# EAGLE design JPhan_Board3 (EAGLE 8.3.2)
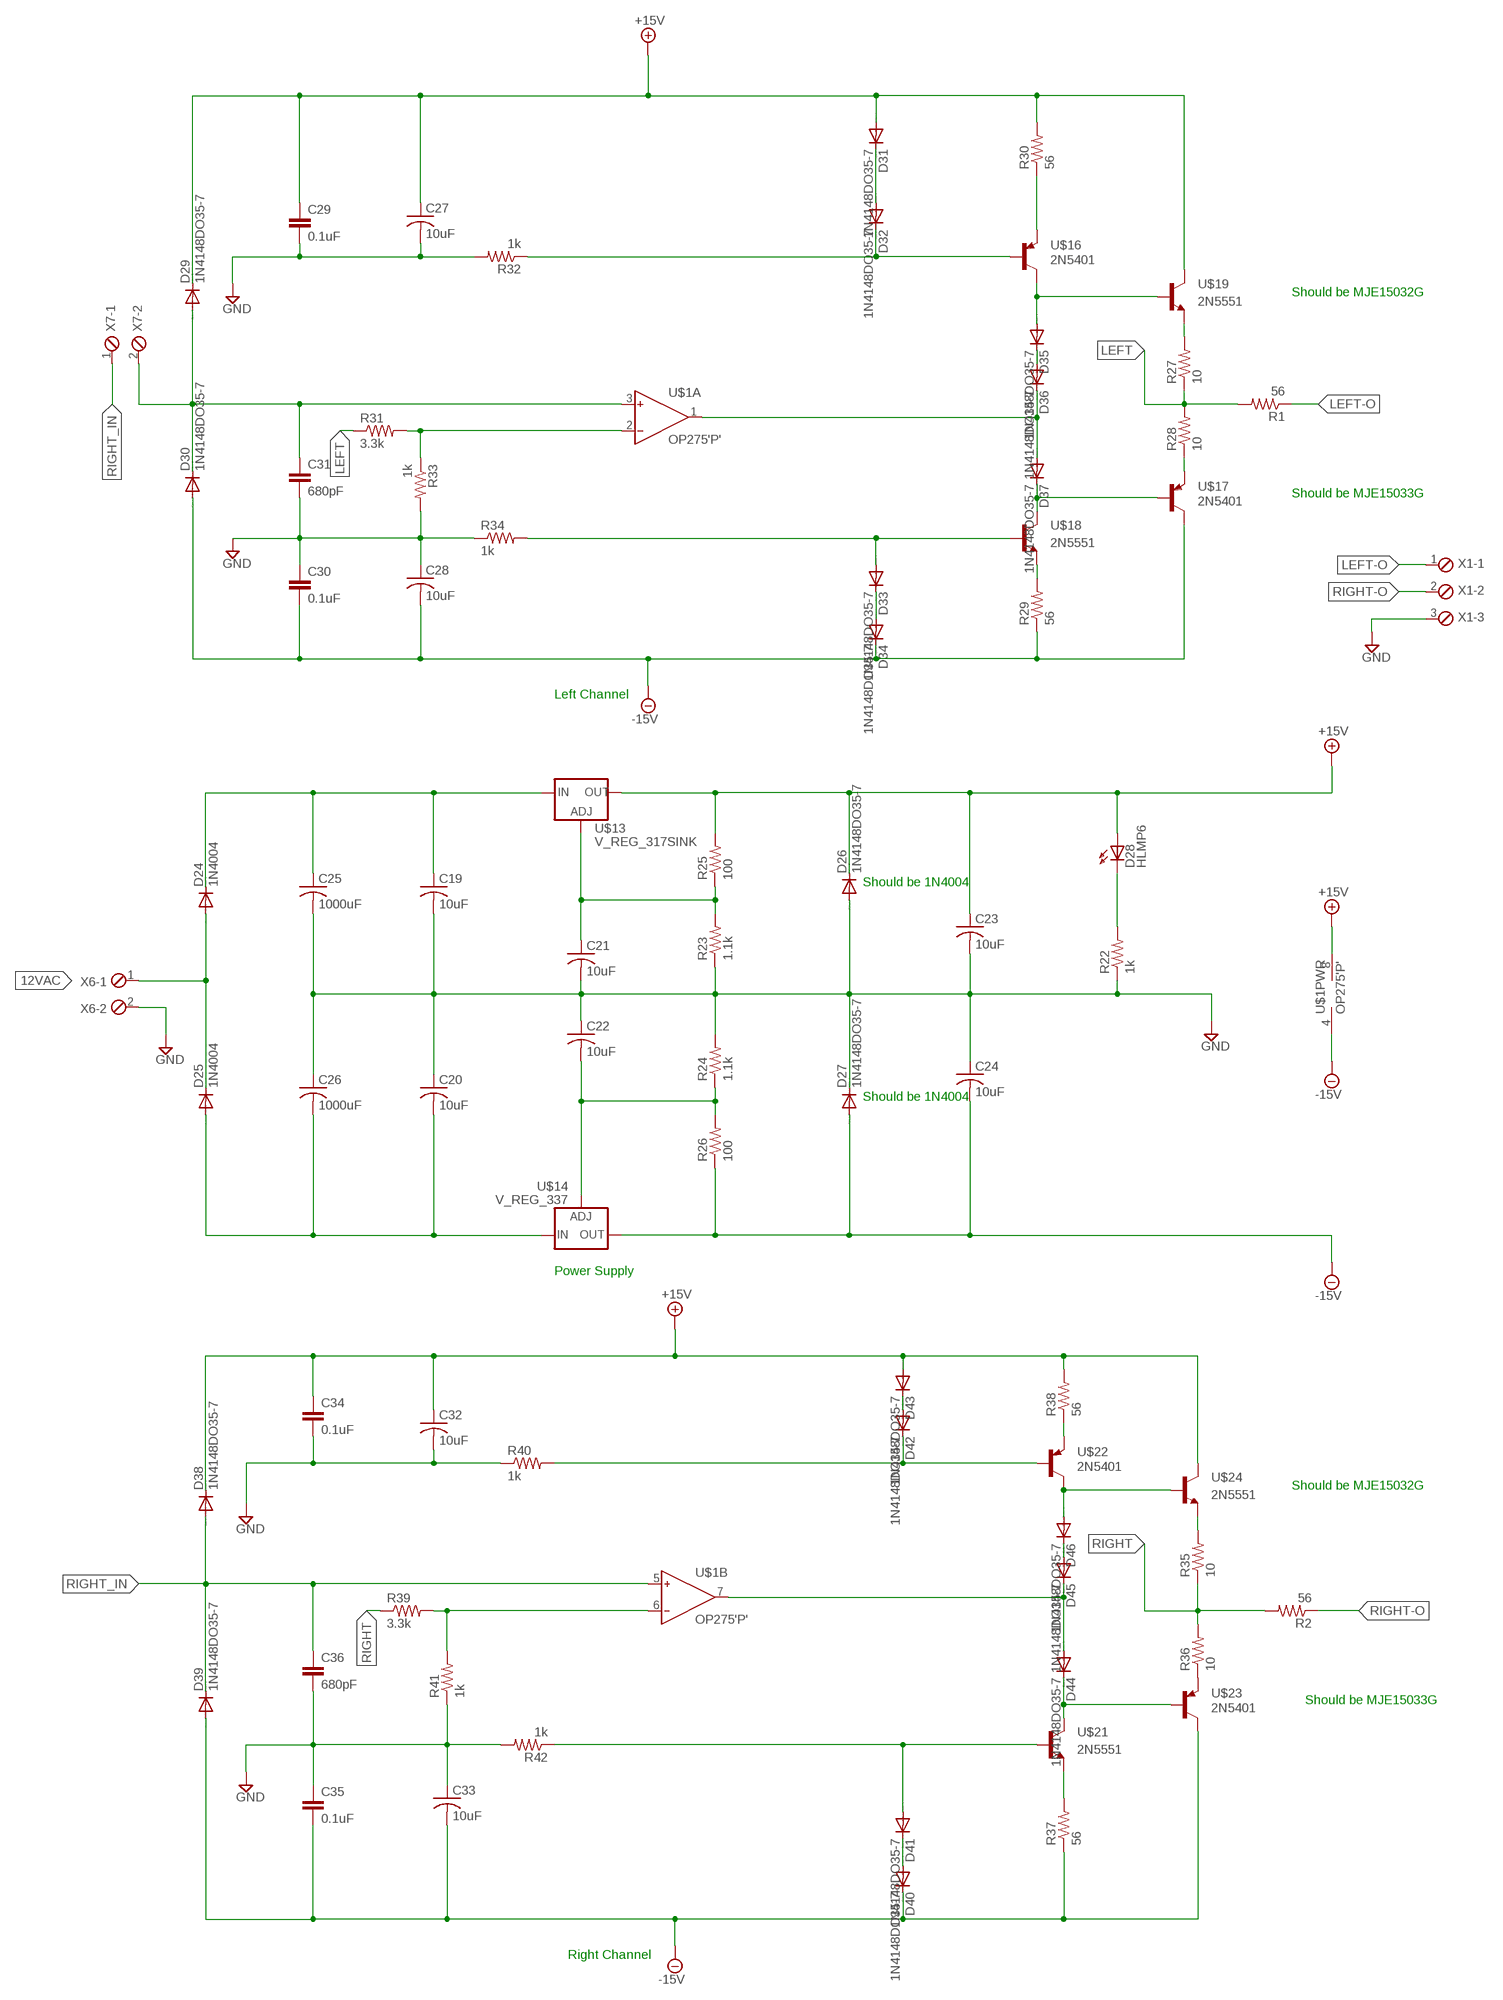
[diagram p0: schematic, sheet 1]

## Parts
C19  10uF  C-US025-030X050  [C025-030X050]
C20  10uF  C-US025-030X050  [C025-030X050]
C21  10uF  C-US025-030X050  [C025-030X050]
C22  10uF  C-US025-030X050  [C025-030X050]
C23  10uF  C-US025-030X050  [C025-030X050]
C24  10uF  C-US025-030X050  [C025-030X050]
C25  1000uF  C-US050-045X075  [C050-045X075]
C26  1000uF  C-US050-045X075  [C050-045X075]
C27  10uF  C-US025-030X050  [C025-030X050]
C28  10uF  C-US025-030X050  [C025-030X050]
C29  0.1uF  C-EU025-024X044  [C025-024X044]
C30  0.1uF  C-EU025-024X044  [C025-024X044]
C31  680pF  C-EU025-024X044  [C025-024X044]
C32  10uF  C-US025-030X050  [C025-030X050]
C33  10uF  C-US025-030X050  [C025-030X050]
C34  0.1uF  C-EU025-024X044  [C025-024X044]
C35  0.1uF  C-EU025-024X044  [C025-024X044]
C36  680pF  C-EU025-024X044  [C025-024X044]
D24  1N4004  [DO41-10]
D25  1N4004  [DO41-10]
D26  1N4148DO35-7  [DO35-7]
D27  1N4148DO35-7  [DO35-7]
D28  HLMP6  [HLMP6]
D29  1N4148DO35-7  [DO35-7]
D30  1N4148DO35-7  [DO35-7]
D31  1N4148DO35-7  [DO35-7]
D32  1N4148DO35-7  [DO35-7]
D33  1N4148DO35-7  [DO35-7]
D34  1N4148DO35-7  [DO35-7]
D35  1N4148DO35-7  [DO35-7]
D36  1N4148DO35-7  [DO35-7]
D37  1N4148DO35-7  [DO35-7]
D38  1N4148DO35-7  [DO35-7]
D39  1N4148DO35-7  [DO35-7]
D40  1N4148DO35-7  [DO35-7]
D41  1N4148DO35-7  [DO35-7]
D42  1N4148DO35-7  [DO35-7]
D43  1N4148DO35-7  [DO35-7]
D44  1N4148DO35-7  [DO35-7]
D45  1N4148DO35-7  [DO35-7]
D46  1N4148DO35-7  [DO35-7]
R1  56  R-US_0204/7  [0204/7]
R2  56  R-US_0204/7  [0204/7]
R22  1k  R-US_0204/7  [0204/7]
R23  1.1k  R-US_0204/7  [0204/7]
R24  1.1k  R-US_0204/7  [0204/7]
R25  100  R-US_0204/7  [0204/7]
R26  100  R-US_0204/7  [0204/7]
R27  10  R-US_0204/7  [0204/7]
R28  10  R-US_0204/7  [0204/7]
R29  56  R-US_0204/7  [0204/7]
R30  56  R-US_0204/7  [0204/7]
R31  3.3k  R-US_0204/7  [0204/7]
R32  1k  R-US_0204/7  [0204/7]
R33  1k  R-US_0204/7  [0204/7]
R34  1k  R-US_0204/7  [0204/7]
R35  10  R-US_0204/7  [0204/7]
R36  10  R-US_0204/7  [0204/7]
R37  56  R-US_0204/7  [0204/7]
R38  56  R-US_0204/7  [0204/7]
R39  3.3k  R-US_0204/7  [0204/7]
R40  1k  R-US_0204/7  [0204/7]
R41  1k  R-US_0204/7  [0204/7]
R42  1k  R-US_0204/7  [0204/7]
U$1  OP275'P'  [DIL08]
U$13  V_REG_317SINK  [TO220-ADJ]
U$14  V_REG_337  [TO220-ADJ-NEG]
U$16  2N5401  [2N5401]
U$17  2N5401  [2N5401]
U$18  2N5551  [2N5551]
U$19  2N5551  [2N5551]
U$21  2N5551  [2N5551]
U$22  2N5401  [2N5401]
U$23  2N5401  [2N5401]
U$24  2N5551  [2N5551]
X1  MPT3  [3POL254]
X6  MPT2  [2POL254]
X7  MPT2  [2POL254]

## Nets
12VAC: D24.A D25.C X6.1
+15V [+15V]: C23.1 C27.1 C29.1 C32.1 C34.1 D26.C D28.A D29.C D31.A D38.C D43.A R25.2 R30.2 R38.2 U$1.8(PWR:V+) U$13.OUT U$19.C U$24.C
-15V [-15V]: C24.2 C28.2 C30.2 C33.2 C35.2 D27.A D30.A D34.C D39.A D40.C R26.1 R29.1 R37.1 U$1.4(PWR:V-) U$14.OUT U$17.C U$23.C
GND [GND]: C19.2 C20.1 C21.2 C22.1 C23.2 C24.1 C25.2 C26.1 C27.2 C28.1 C29.2 C30.1 C31.2 C32.2 C33.1 C34.2 C35.1 C36.2 D26.A D27.C R22.1 R23.1 R24.2 R32.2 R33.2 R34.1 R40.1 R41.1 R42.2 X1.3 X6.2
LEFT: R1.2 R27.1 R28.2 R31.1
LEFT-O: R1.1 X1.1
N$1: C31.1 D29.A D30.C U$1.3(A:IN+) X7.2
N$4: R31.2 R33.1 U$1.2(A:IN-)
N$43: C19.1 C25.1 D24.C U$13.IN
N$45: C20.2 C26.2 D25.A U$14.IN
N$47: C21.1 R23.2 R25.1 U$13.ADJ
N$48: C22.2 R24.1 R26.2 U$14.ADJ
N$50: D28.K R22.2
N$51: D35.A U$16.C U$19.B
N$56: D32.C R32.1 U$16.B
N$57: D31.C D32.A
N$58: R30.1 U$16.E
N$59: D35.C D36.A
N$60: D36.C D37.A U$1.1(A:OUT)
N$61: D37.C U$17.B U$18.C
N$62: R29.2 U$18.E
N$63: D33.C D34.A
N$64: R27.2 U$19.E
N$65: R28.1 U$17.E
N$67: D33.A R34.2 U$18.B
N$71: R39.2 R41.2 U$1.6(B:IN-)
N$73: D40.A D41.C
N$74: R37.2 U$21.E
N$75: D44.C U$21.C U$23.B
N$76: D44.A D45.C U$1.7(B:OUT)
N$77: D45.A D46.C
N$78: D46.A U$22.C U$24.B
N$79: D42.A D43.C
N$80: D42.C R40.2 U$22.B
N$81: D41.A R42.1 U$21.B
N$82: R35.2 U$24.E
N$83: R36.1 U$23.E
N$84: R38.1 U$22.E
RIGHT: R2.2 R35.1 R36.2 R39.1
RIGHT-O: R2.1 X1.2
RIGHT_IN: C36.1 D38.A D39.C U$1.5(B:IN+) X7.1

## Notes on the sheet
- Should be MJE15032G
- Should be MJE15033G
- Left Channel
- Should be 1N4004
- Should be 1N4004
- Power Supply
- Should be MJE15032G
- Should be MJE15033G
- Right Channel

## Library data of the parts
C19-C28 C32 C33 = rcl:C-US: CAPACITOR, American symbol
C29-C31 C34-C36 = rcl:C-EU: CAPACITOR, European symbol
D24 D25 = diode:1N4004: DIODE general purpose rectifier, 1 A
D26 D27 D29-D46 = diode:1N4148: DIODE high speed (Philips)
D28 = display-hp:HLMP6: LED 2mm horizontal; MF: AGILENT TECHNOLOGIES; MPN: HLMP-6500; OC_FARNELL: 1652490; OC_NEWARK: 40K0088
R1 R2 R22-R42 = resistor:R-US_: RESISTOR, American symbol
U$1 = engr301-proj :OP275: OP275 - Dual Bipolar/JFET Audio Op-amp
U$13 = engr301-proj :V_REG_317: Voltage Regulator Standard LM317 adjustable voltage regulator. AOI (Adjust Output Input). Google 'LM317 Calculator' for easy to use app to get the two resistor values needed. 240/720 for 5V output. 240/390 for 3.3V output. Spark Fun Electronics SKU : COM-00527
U$14 = engr301-proj :V_REG_337: LM-337 Negative Adjustable Voltage Regulator
U$16 U$17 U$22 U$23 = engr301-proj :2N5401
U$18 U$19 U$21 U$24 = engr301-proj :2N5551
X1 = con-phoenix-254:MPT3: PHOENIX CONNECTOR; OC_FARNELL: unknown; OC_NEWARK: unknown
X6 X7 = con-phoenix-254:MPT2: PHOENIX CONNECTOR; OC_FARNELL: unknown; OC_NEWARK: unknown

## Net classes
0 default: width 0.356 mm, drill 0.254 mm, clearance 0.254 mm
1 GND: width 0.406 mm, drill 0.406 mm, clearance 0.406 mm
2 +15V: width 0.61 mm, drill 0.61 mm, clearance 0.406 mm
3 -15V: width 0.61 mm, drill 0.61 mm, clearance 0.406 mm

## Board
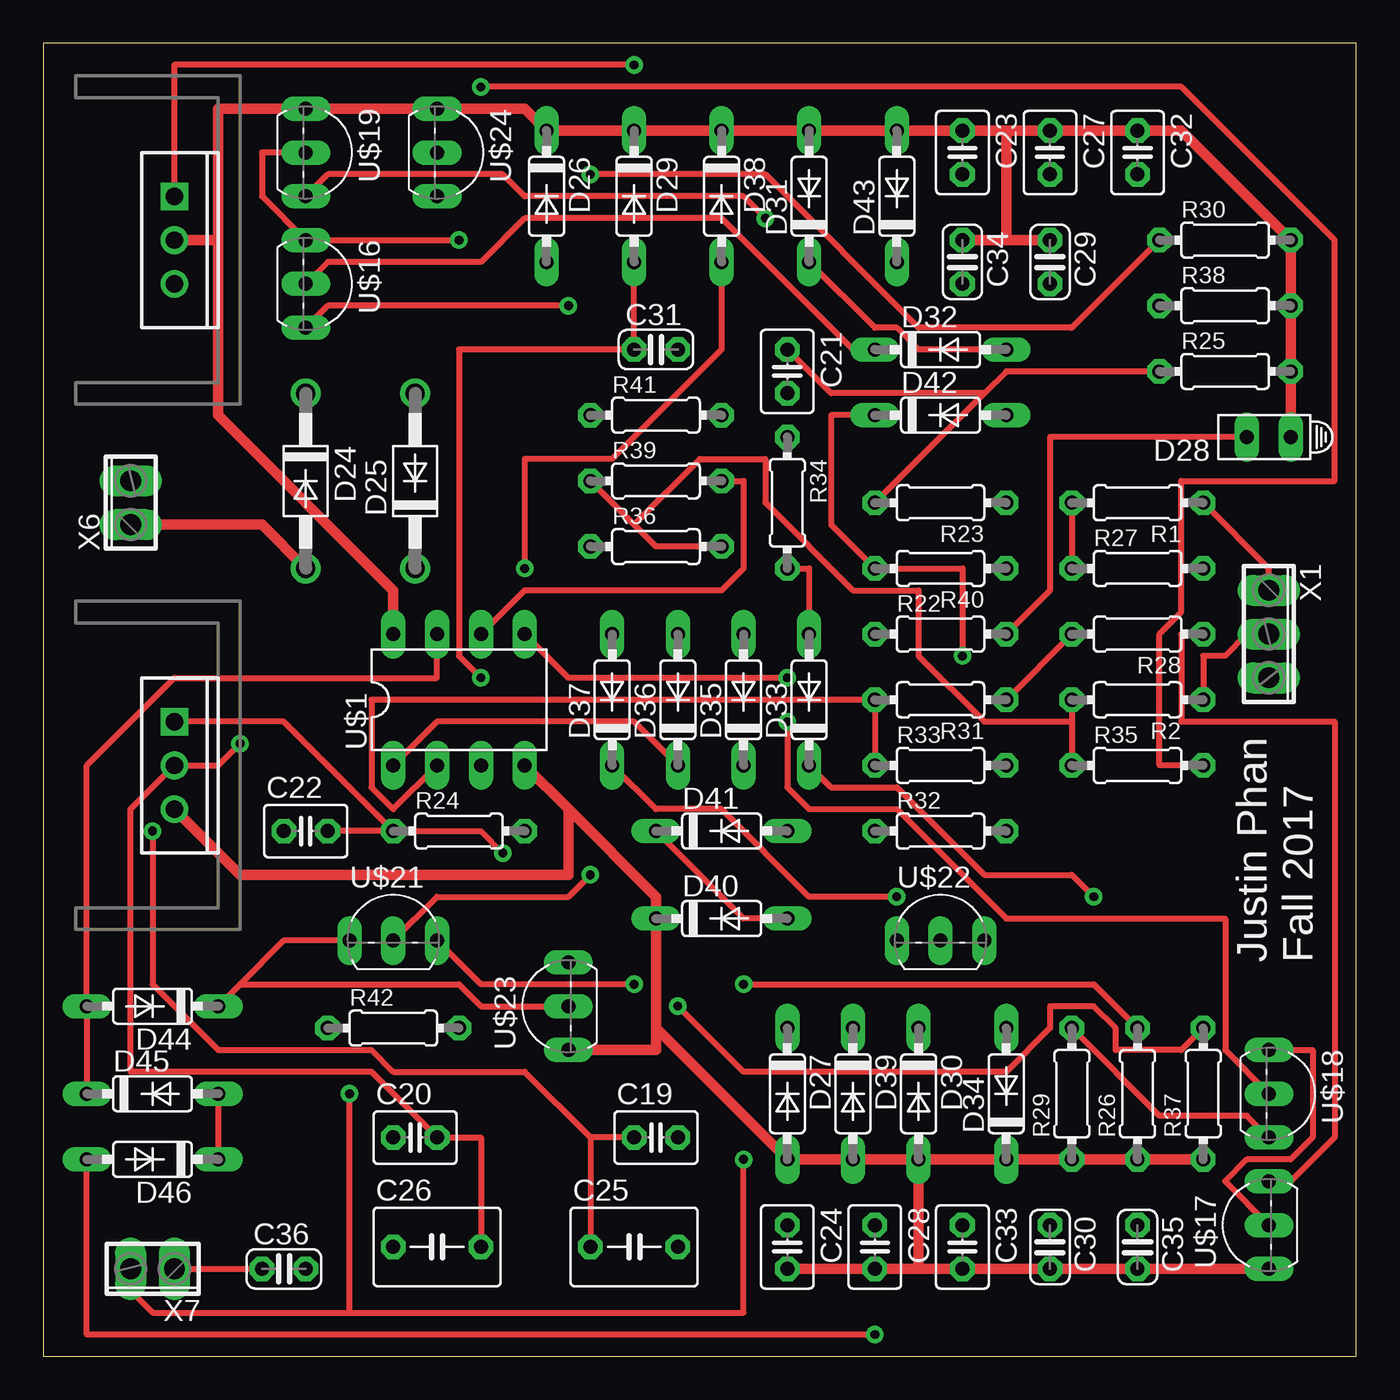
[diagram p1: board, top side]
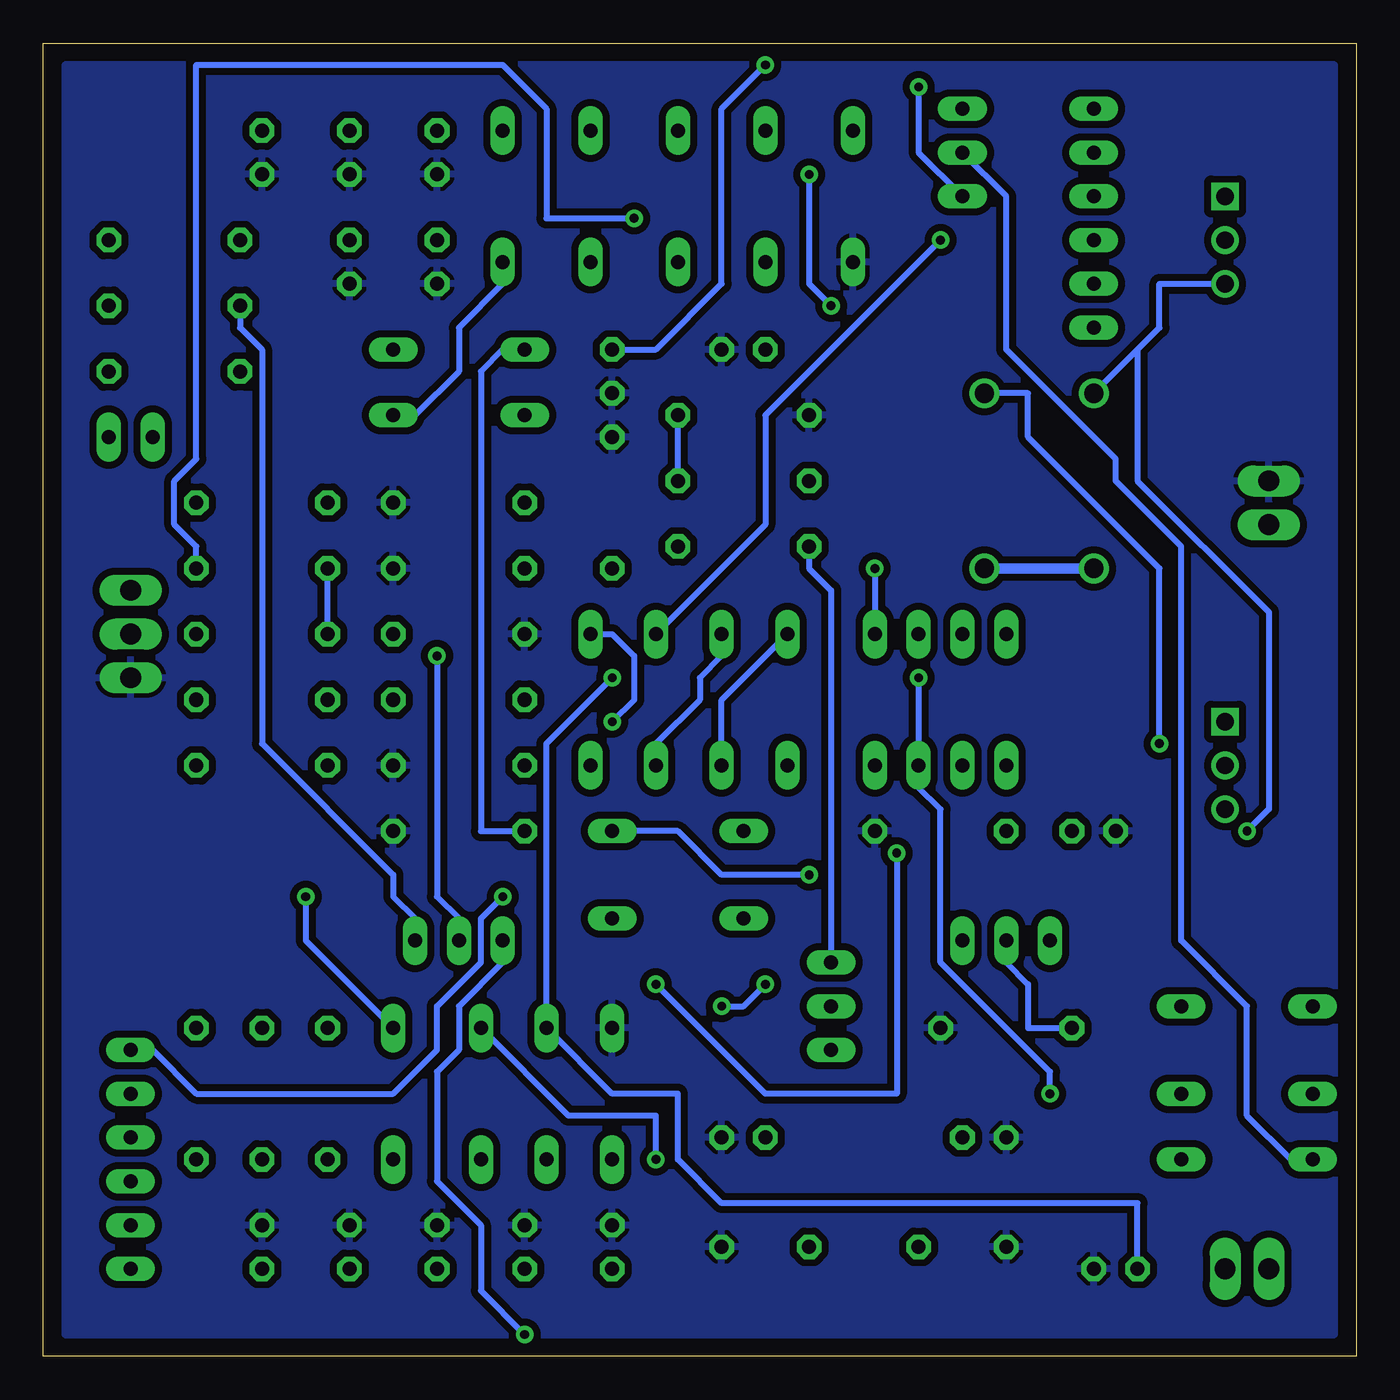
[diagram p2: board, bottom side, seen from below]

Size 76.2 x 76.2 mm. Coordinates in mm from the lower left corner, seen from the top.
Outline: 0,0 76.2,0 76.2,76.2 0,76.2 0,0
Copper layers (1*16): Top 0.035mm / dielectric 1.5mm / Bottom 0.035mm
Design rules "engr301_new": minimum track width 8mil, minimum drill 20mil, track to track 8mil, track to pad 10mil, pad to pad 10mil, via to via 10mil, smd to smd 8mil, copper to edge 15mil, drill to drill 8mil, minimum pad ring 12mil, minimum via ring 10mil, stop-mask expansion 4mil, vias tented up to drill 25mil, thermal gap 10mil

### Footprints (pad centres in the part's own frame; a part is rotated, then mirrored left to right if it is on the bottom)
C025-030X050 = drill 0.813 octagon: 1 -1.27,0; 2 1.27,0
C050-045X075 = drill 0.813 octagon: 1 -2.54,0; 2 2.54,0
C025-024X044 = drill 0.813 octagon: 1 -1.27,0; 2 1.27,0
DO41-10 = drill 1.118: A 5.08,0; C -5.08,0
DO35-7 = drill 0.813 long: A 3.81,0; C -3.81,0
HLMP6 = drill 0.813 long: A -1.27,0; K 1.27,0
0204/7 = drill 0.813 octagon: 1 -3.81,0; 2 3.81,0
DIL08 = drill 0.813 long: 1 -3.81,-3.81; 2 -1.27,-3.81; 3 1.27,-3.81; 4 3.81,-3.81; 5 3.81,3.81; 6 1.27,3.81; 7 -1.27,3.81; 8 -3.81,3.81
TO220-ADJ = drill 1 square: ADJ -2.54,0 | drill 1: IN 2.54,0; OUT 0,0
TO220-ADJ-NEG = drill 1 square: ADJ -2.54,0 | drill 1: IN 0,0; OUT 2.54,0
2N5401 = drill 0.813 long: B 0,0; C -2.54,0; E 2.54,0
2N5551 = drill 0.813 long: B 0,0; C -2.54,0; E 2.54,0
3POL254 = drill 1.2 long: 1 -2.54,0; 2 0,0; 3 2.54,0
2POL254 = drill 1.2 long: 1 -1.27,0; 2 1.27,0

### Placement (x,y rotation side)
C19  35.56,12.7 0 top
C20  21.59,12.7 0 top
C21  43.18,57.15 270 top
C22  15.24,30.48 0 top
C23  53.34,69.85 270 top
C24  43.18,6.35 270 top
C25  34.29,6.35 0 top
C26  22.86,6.35 0 top
C27  58.42,69.85 270 top
C28  48.26,6.35 270 top
C29  58.42,63.5 270 top
C30  58.42,6.35 270 top
C31  35.56,58.42 0 top
C32  63.5,69.85 270 top
C33  53.34,6.35 270 top
C34  53.34,63.5 270 top
C35  63.5,6.35 270 top
C36  13.97,5.08 0 top
D24  15.24,50.8 270 top
D25  21.59,50.8 90 top
D26  29.21,67.31 270 top
D27  43.18,15.24 270 top
D28  71.12,53.34 180 top
D29  34.29,67.31 270 top
D30  50.8,15.24 270 top
D31  44.45,67.31 90 top
D32  52.07,58.42 0 top
D33  44.45,38.1 90 top
D34  55.88,15.24 90 top
D35  40.64,38.1 90 top
D36  36.83,38.1 90 top
D37  33.02,38.1 90 top
D38  39.37,67.31 270 top
D39  46.99,15.24 270 top
D40  39.37,25.4 0 top
D41  39.37,30.48 0 top
D42  52.07,54.61 0 top
D43  49.53,67.31 90 top
D44  6.35,20.32 180 top
D45  6.35,15.24 0 top
D46  6.35,11.43 180 top
R1  63.5,49.53 180 top
R2  63.5,38.1 180 top
R22  52.07,41.91 0 top
R23  52.07,49.53 180 top
R24  24.13,30.48 0 top
R25  68.58,57.15 0 top
R26  63.5,15.24 90 top
R27  63.5,45.72 0 top
R28  63.5,41.91 180 top
R29  59.69,15.24 90 top
R30  68.58,64.77 0 top
R31  52.07,38.1 180 top
R32  52.07,30.48 0 top
R33  52.07,34.29 0 top
R34  43.18,49.53 270 top
R35  63.5,34.29 0 top
R36  35.56,46.99 0 top
R37  67.31,15.24 90 top
R38  68.58,60.96 0 top
R39  35.56,50.8 0 top
R40  52.07,45.72 180 top
R41  35.56,54.61 0 top
R42  20.32,19.05 0 top
U$1  24.13,38.1 0 top
U$13  7.62,64.77 270 top
U$14  7.62,34.29 270 top
U$16  15.24,62.23 270 top
U$17  71.12,7.62 90 top
U$18  71.12,15.24 270 top
U$19  15.24,69.85 270 top
U$21  20.32,24.13 0 top
U$22  52.07,24.13 0 top
U$23  30.48,20.32 90 top
U$24  22.86,69.85 270 top
X1  71.12,41.91 270 top
X6  5.08,49.53 90 top
X7  6.35,5.08 180 top

### Tracks (layer width: path | path; a pad name or v marks a point on that pad's centre or on a via)
12VAC
  Top 0.61: D24.A 12.7,48.26 X6.1
  Bottom 0.61: D24.A D25.C
+15V
  Top 0.61: U$1.8 20.32,44.45 10.16,54.61 10.16,64.77 | U$13.OUT 10.16,64.77 | D28.A R25.2 R38.2 R30.2 66.04,71.12 C32.1 C27.1 55.88,71.12 | C29.1 55.88,64.77 | 55.88,64.77 C34.1 | 55.88,71.12 C23.1 D43.A D31.A D38.C D29.C D26.C 27.94,72.39 U$24.C U$19.C 10.16,72.39 10.16,64.77 | 55.88,71.12 55.88,64.77
-15V
  Top 0.61: D30.A D39.A D27.A 35.56,19.05 | R37.1 R26.1 R29.1 D34.C D30.A | C24.2 C28.2 50.8,5.08 | 50.8,5.08 C33.2 C30.2 C35.2 U$17.C | 50.8,5.08 D30.A | U$23.C 35.56,17.78 35.56,19.05 | 35.56,19.05 D40.C 35.56,26.67 30.48,31.75 | 30.48,31.75 U$1.4 | U$14.OUT 11.43,27.94 30.48,27.94 30.48,31.75
GND
  pour Bottom: 1.27,74.93 74.93,74.93 74.93,1.27 1.27,1.27
LEFT
  Top 0.356: R1.2 R27.1 | R28.2 R31.1
  Bottom 0.356: R28.2 R27.1
LEFT-O
  Top 0.356: R1.1 71.12,45.72 X1.1
N$1  (via drill 0.51)
  Top 0.356: v25.4,39.37 24.13,40.64 24.13,58.42 C31.1 D29.A | v40.64,11.43 40.64,2.54 17.78,2.54 | 17.78,2.54 6.35,2.54 5.08,3.81 X7.2 | 17.78,2.54 v17.78,15.24
  Bottom 0.356: v25.4,39.37 U$1.3 25.4,33.02 24.13,31.75 24.13,22.86 17.78,16.51 v17.78,15.24 | D30.C 45.72,13.97 40.64,13.97 v40.64,11.43
N$4
  Top 0.356: U$1.2 20.32,31.75 19.05,33.02 19.05,38.1 R31.2 R33.1
N$43  (via drill 0.51)
  Top 0.356: 31.75,12.7 C25.1 | C19.1 31.75,12.7 | 31.75,12.7 27.94,16.51 20.32,16.51 19.05,17.78 10.16,17.78 6.35,21.59 v6.35,30.48
  Bottom 0.356: U$13.IN 11.43,62.23 11.43,59.69 12.7,58.42 | D24.C 12.7,58.42 | v6.35,30.48 5.08,31.75 5.08,43.18 12.7,50.8 12.7,58.42
N$45  (via drill 0.51)
  Top 0.356: C26.2 25.4,12.7 C20.2 19.05,16.51 5.08,16.51 5.08,31.75 U$14.IN 10.16,34.29 v11.43,35.56
  Bottom 0.356: D25.A 19.05,55.88 19.05,53.34 11.43,45.72 v11.43,35.56
N$47  (via drill 0.51)
  Top 0.356: 54.61,55.88 55.88,57.15 R25.1 | 54.61,55.88 R23.2 | C21.1 45.72,55.88 54.61,55.88 | U$13.ADJ 7.62,74.93 v34.29,74.93
  Bottom 0.356: v34.29,74.93 36.83,72.39 36.83,62.23 40.64,58.42 C21.1
N$48  (via drill 0.51)
  Top 0.356: R24.1 C22.2 | R26.2 60.96,21.59 v40.64,21.59 | v26.67,29.21 25.4,30.48 R24.1 | U$14.ADJ 13.97,36.83 R24.1
  Bottom 0.356: v40.64,21.59 34.29,15.24 26.67,15.24 v26.67,29.21
N$50
  Top 0.356: R22.2 58.42,44.45 58.42,53.34 D28.K
N$51  (via drill 0.51)
  Top 0.356: U$19.B 12.7,69.85 12.7,67.31 U$16.C v24.13,64.77
  Bottom 0.356: D35.A 34.29,48.26 34.29,54.61 v24.13,64.77
N$56
  Top 0.356: U$16.B 16.51,63.5 25.4,63.5 27.94,66.04 39.37,66.04 46.99,58.42 D32.C
  Bottom 0.356: R32.1 50.8,30.48 50.8,57.15 49.53,58.42 D32.C
N$57
  Top 0.356: D31.C 48.26,59.69 49.53,59.69 50.8,58.42 D32.A
N$58  (via drill 0.51)
  Top 0.356: U$16.E 16.51,60.96 v30.48,60.96 | v31.75,68.58 41.91,68.58 50.8,59.69 59.69,59.69 R30.1
  Bottom 0.356: v30.48,60.96 31.75,62.23 v31.75,68.58
N$59
  Bottom 0.356: D35.C 40.64,35.56 38.1,38.1 38.1,39.37 36.83,40.64 D36.A
N$60
  Top 0.356: U$1.1 22.86,36.83 34.29,36.83 D36.C
  Bottom 0.356: D37.A 36.83,38.1 D36.C
N$61  (via drill 0.51)
  Top 0.356: U$17.B 68.58,10.16 69.85,11.43 72.39,11.43 73.66,12.7 73.66,17.78 U$18.C | D37.C 35.56,31.75 39.37,31.75 44.45,26.67 v49.53,26.67
  Bottom 0.356: v49.53,26.67 50.8,25.4 50.8,22.86 53.34,20.32 53.34,17.78 55.88,15.24 67.31,15.24 69.85,17.78 U$18.C
N$62
  Top 0.356: R29.2 64.77,13.97 69.85,13.97 U$18.E
N$63  (via drill 0.51)
  Top 0.356: v60.96,26.67 59.69,27.94 54.61,27.94 49.53,33.02 45.72,33.02 D33.C
  Bottom 0.356: D34.A 60.96,24.13 v60.96,26.67
N$64  (via drill 0.51)
  Top 0.356: U$19.E 16.51,68.58 26.67,68.58 27.94,67.31 40.64,67.31 v41.91,66.04
  Bottom 0.356: v41.91,66.04 46.99,66.04 46.99,72.39 49.53,74.93 67.31,74.93 67.31,52.07 68.58,50.8 68.58,48.26 67.31,46.99 R27.2
N$65
  Top 0.356: U$17.E 72.39,10.16 74.93,12.7 74.93,36.83 66.04,36.83 66.04,41.91 R28.1
N$67  (via drill 0.51)
  Top 0.356: D33.A 44.45,45.72 R34.2 | U$18.B 68.58,17.78 68.58,25.4 55.88,25.4 49.53,31.75 44.45,31.75 43.18,33.02 v43.18,36.83
  Bottom 0.356: v43.18,36.83 41.91,38.1 41.91,40.64 43.18,41.91 D33.A
N$71
  Top 0.356: U$1.6 27.94,44.45 39.37,44.45 40.64,45.72 40.64,50.8 R39.2
  Bottom 0.356: R39.2 R41.2
N$73
  Top 0.356: D41.C 40.64,25.4 D40.A
N$74  (via drill 0.51)
  Top 0.356: U$21.E 25.4,21.59 v34.29,21.59 | v36.83,20.32 40.64,16.51 55.88,16.51 58.42,19.05 58.42,20.32 60.96,20.32 62.23,19.05 62.23,17.78 66.04,17.78 R37.2
  Bottom 0.356: v34.29,21.59 35.56,20.32 v36.83,20.32
N$75
  Top 0.356: 11.43,21.59 13.97,24.13 U$21.C | 11.43,21.59 D44.C | U$23.B 25.4,20.32 24.13,21.59 11.43,21.59
N$76
  Top 0.356: D45.C D44.A 2.54,34.29 7.62,39.37 22.86,39.37 U$1.7
N$77
  Top 0.356: D45.A D46.C
N$78  (via drill 0.51)
  Top 0.356: D46.A 2.54,1.27 v48.26,1.27
  Bottom 0.356: v48.26,1.27 50.8,3.81 50.8,7.62 53.34,10.16 53.34,16.51 52.07,17.78 52.07,20.32 49.53,22.86 U$22.C | U$24.B 20.32,67.31 20.32,58.42 13.97,52.07 13.97,50.8 10.16,46.99 10.16,24.13 6.35,20.32 6.35,13.97 3.81,11.43 D46.A
N$79
  Bottom 0.356: D42.A 54.61,54.61 52.07,57.15 52.07,59.69 49.53,62.23 D43.C
N$80  (via drill 0.51)
  Top 0.356: D42.C 45.72,54.61 45.72,48.26 R40.2 53.34,45.72 v53.34,40.64
  Bottom 0.356: U$22.B 52.07,25.4 53.34,26.67 v53.34,40.64
N$81  (via drill 0.51)
  Top 0.356: v31.75,27.94 30.48,26.67 22.86,26.67 U$21.B
  Bottom 0.356: R42.1 19.05,19.05 19.05,21.59 20.32,22.86 U$21.B | D41.A 39.37,30.48 36.83,27.94 v31.75,27.94
N$82  (via drill 0.51)
  Top 0.356: v25.4,73.66 66.04,73.66 74.93,64.77 74.93,50.8 66.04,50.8 66.04,43.18 64.77,41.91 64.77,34.29 R35.2
  Bottom 0.356: U$24.E 25.4,69.85 v25.4,73.66
N$83
  Bottom 0.356: U$23.E 30.48,44.45 31.75,45.72 R36.1
N$84
  Bottom 0.356: U$22.E 54.61,25.4 55.88,26.67 55.88,27.94 63.5,35.56 63.5,58.42 64.77,59.69 R38.1
RIGHT
  Top 0.356: R2.2 59.69,36.83 | 59.69,36.83 R35.1 | 34.29,48.26 35.56,46.99 R36.2 | 34.29,48.26 R39.1 | 59.69,36.83 54.61,36.83 50.8,40.64 50.8,44.45 46.99,44.45 41.91,49.53 41.91,52.07 38.1,52.07 34.29,48.26
RIGHT-O
  Top 0.356: R2.1 67.31,40.64 68.58,40.64 69.85,41.91 X1.2
RIGHT_IN  (via drill 0.51)
  Top 0.356: v27.94,45.72 27.94,52.07 33.02,52.07 39.37,58.42 D38.A | X7.1 C36.1 | U$1.5 30.48,39.37 v43.18,39.37
  Bottom 0.356: v27.94,45.72 U$1.5 | C36.1 12.7,8.89 36.83,8.89 39.37,11.43 39.37,15.24 43.18,15.24 D39.C 46.99,35.56 v43.18,39.37

### Text on the board
tNames: Justin Phan / Fall 2017